# EAGLE schematic 24V AC SSR Board (EAGLE 7.3.0)
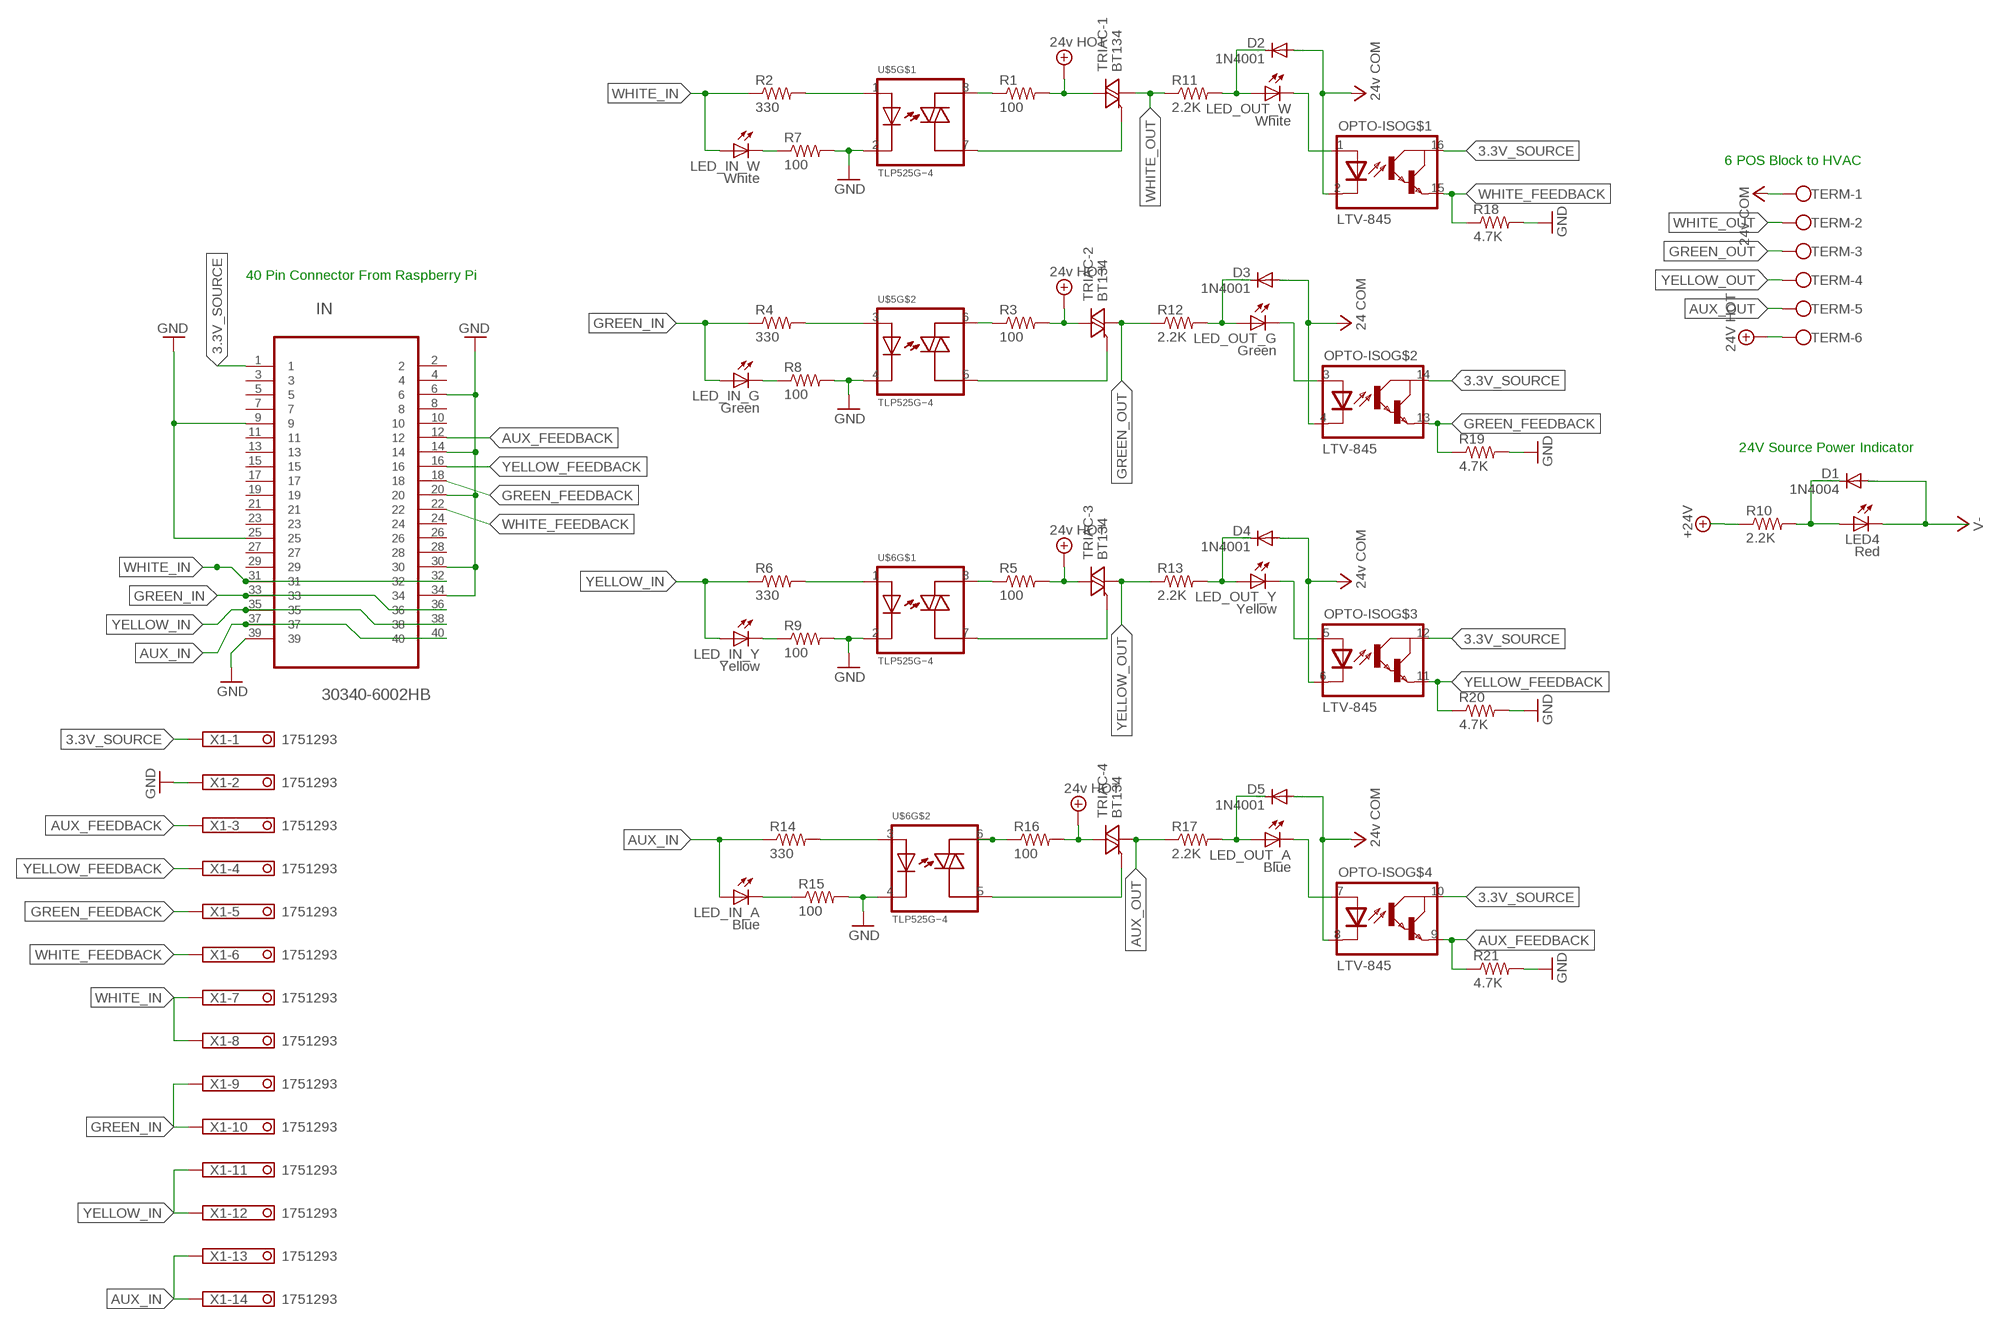
[diagram p0: schematic, sheet 1]

## Parts
D1  1N4004  [DO41-10]
D2  1N4001  1N4004  [DO41-10]
D3  1N4001  1N4004  [DO41-10]
D4  1N4001  1N4004  [DO41-10]
D5  1N4001  1N4004  [DO41-10]
IN  30340-6002HB  2540-6002UB  [3M_2540-6002UB]
LED4  Red  LED3MM  [LED3MM]
LED_IN_A  Blue  LED3MM  [LED3MM]
LED_IN_G  Green  LED3MM  [LED3MM]
LED_IN_W  White  LED3MM  [LED3MM]
LED_IN_Y  Yellow  LED3MM  [LED3MM]
LED_OUT_A  Blue  LED3MM  [LED3MM]
LED_OUT_G  Green  LED3MM  [LED3MM]
LED_OUT_W  White  LED3MM  [LED3MM]
LED_OUT_Y  Yellow  LED3MM  [LED3MM]
OPTO-ISO  LTV-845  [DIL16]
R1  100  R-US_0204/7  [0204/7]
R2  330  R-US_0204/7  [0204/7]
R3  100  R-US_0204/7  [0204/7]
R4  330  R-US_0204/7  [0204/7]
R5  100  R-US_0204/7  [0204/7]
R6  330  R-US_0204/7  [0204/7]
R7  100  R-US_0204/7  [0204/7]
R8  100  R-US_0204/7  [0204/7]
R9  100  R-US_0204/7  [0204/7]
R10  2.2K  R-US_0204/7  [0204/7]
R11  2.2K  R-US_0204/7  [0204/7]
R12  2.2K  R-US_0204/7  [0204/7]
R13  2.2K  R-US_0204/7  [0204/7]
R14  330  R-US_0204/7  [0204/7]
R15  100  R-US_0204/7  [0204/7]
R16  100  R-US_0204/7  [0204/7]
R17  2.2K  R-US_0204/7  [0204/7]
R18  4.7K  R-US_0204/7  [0204/7]
R19  4.7K  R-US_0204/7  [0204/7]
R20  4.7K  R-US_0204/7  [0204/7]
R21  4.7K  R-US_0204/7  [0204/7]
TERM  W237-6  [W237-6]
TRIAC-1  BT134  [SOT82]
TRIAC-2  BT134  [SOT82]
TRIAC-3  BT134  [SOT82]
TRIAC-4  BT134  [SOT82]
U$5  TLP525G−4  [DIL08]
U$6  TLP525G−4  [DIL08]
X1  1751293  [1751293]

## Nets
3.3V_SOURCE: IN.1 OPTO-ISO.10(COLLECTOR) OPTO-ISO.12(COLLECTOR) OPTO-ISO.14(COLLECTOR) OPTO-ISO.16(COLLECTOR) X1.1
+24V: R1.2 R3.2 R5.2 R10.1 R16.2 TERM.6 TRIAC-1.2(A2) TRIAC-2.2(A2) TRIAC-3.2(A2) TRIAC-4.2(A2) ; supply symbol labelled 24v HOT, 24V HOT
AUX_FEEDBACK: IN.12 OPTO-ISO.9(EMITTER) R21.1 X1.3
AUX_IN: IN.37 IN.40 LED_IN_A.A R14.1 X1.13 X1.14
AUX_OUT: R17.1 TERM.5 TRIAC-4.1(A1)
GND: IN.6 IN.9 IN.14 IN.20 IN.25 IN.30 IN.34 IN.39 R7.2 R8.2 R9.2 R15.2 R18.2 R19.2 R20.2 R21.2 U$5.2(CATHODE) U$5.4(CATHODE) U$6.2(CATHODE) U$6.4(CATHODE) X1.2
GREEN_FEEDBACK: IN.18 OPTO-ISO.13(EMITTER) R19.1 X1.5
GREEN_IN: IN.33 IN.36 LED_IN_G.A R4.1 X1.9 X1.10
GREEN_OUT: R12.1 TERM.3 TRIAC-2.1(A1)
N$1: TRIAC-1.3(G) U$5.7(T1)
N$2: R2.2 U$5.1(ANNODE)
N$3: TRIAC-4.3(G) U$6.5(T1)
N$4: R1.1 U$5.8(T2)
N$5: TRIAC-3.3(G) U$6.7(T1)
N$6: R4.2 U$5.3(ANNODE)
N$7: TRIAC-2.3(G) U$5.5(T1)
N$8: R3.1 U$5.6(T2)
N$9: LED_OUT_W.K(C) OPTO-ISO.1(ANNODE)
N$10: R6.2 U$6.1(ANNODE)
N$11: LED_OUT_G.K(C) OPTO-ISO.3(ANNODE)
N$12: R5.1 U$6.8(T2)
N$13: LED_OUT_Y.K(C) OPTO-ISO.5(ANNODE)
N$14: LED_OUT_A.K(C) OPTO-ISO.7(ANNODE)
N$17: LED_IN_W.K(C) R7.1
N$18: LED_IN_G.K(C) R8.1
N$20: LED_IN_Y.K(C) R9.1
N$21: D2.C LED_OUT_W.A R11.2
N$22: D3.C LED_OUT_G.A R12.2
N$23: D4.C LED_OUT_Y.A R13.2
N$24: D1.C LED4.A R10.2
N$27: R14.2 U$6.3(ANNODE)
N$28: LED_IN_A.K(C) R15.1
N$29: R16.1 U$6.6(T2)
N$30: D5.C LED_OUT_A.A R17.2
V-: D1.A D2.A D3.A D4.A D5.A LED4.K(C) OPTO-ISO.2(CATHODE) OPTO-ISO.4(CATHODE) OPTO-ISO.6(CATHODE) OPTO-ISO.8(CATHODE) TERM.1 ; supply symbol labelled 24v COM, 24 COM
WHITE_FEEDBACK: IN.22 OPTO-ISO.15(EMITTER) R18.1 X1.6
WHITE_IN: IN.31 IN.32 LED_IN_W.A R2.1 X1.7 X1.8
WHITE_OUT: R11.1 TERM.2 TRIAC-1.1(A1)
YELLOW_FEEDBACK: IN.16 OPTO-ISO.11(EMITTER) R20.1 X1.4
YELLOW_IN: IN.35 IN.38 LED_IN_Y.A R6.1 X1.11 X1.12
YELLOW_OUT: R13.1 TERM.4 TRIAC-3.1(A1)
Unconnected: IN.2 IN.3 IN.4 IN.5 IN.7 IN.8 IN.10 IN.11 IN.13 IN.15 IN.17 IN.19 IN.21 IN.23 IN.24 IN.26 IN.27 IN.28 IN.29

## Notes on the sheet
- 6 POS Block to HVAC
- 40 Pin Connector From Raspberry Pi
- 24V Source Power Indicator

## Library data of the parts
D1-D5 = diode:1N4004: DIODE general purpose rectifier, 1 A
IN = 3M_By_element14_Batch_1:2540-6002UB: Four-Wall Header; MPN: 2540-6002UB; OC_FARNELL: 1368965; OC_NEWARK: 46F4732; PACKAGE: Four-Wall Header, 40way; SUPPLIER: 3M
LED4 LED_IN_A LED_IN_G LED_IN_W LED_IN_Y LED_OUT_A LED_OUT_G LED_OUT_W LED_OUT_Y = led:LED: LED OSRAM: - CHIPLED LG R971, LG N971, LY N971, LG Q971, LY Q971, LO R971, LY R971 LH N974, LH R974 LS Q976, LO Q976, LY Q976 LO Q996 - Hyper CHIPLED LW Q18S LB Q993, LB Q99A, LB R99A - SideLED LS A670, LO A670, LY A670, LG A670, LP A670 LB A673, LV A673, LT A673, LW A673 LH A674 LY A675 LS A676, LA A676, LO A676, LY A676, LW A676 LS A679, LY A679, LG A679 - Hyper Micro SIDELED® LS Y876, LA Y876, LO Y876, LY Y876 LT Y87S - SmartLED LW L88C, LW L88S LB L89C, LB L89S, LG L890 LS L89K, LO L89K, LY L89K LS L896, LA L896, LO L896, LY L896 - TOPLED LS T670, LO T670, LY T670, LG T670, LP T670 LSG T670, LSP T670, LSY T670, LOP T670, LYG T670 LG T671, LOG T671, LSG T671 LB T673, LV T673, LT T673, LW T673 LH T674 LS T676, LA T676, LO T676, LY T676, LB T676, LH T676, LSB T676, LW T676 LB T67C, LV T67C, LT T67C, LS T67K, LO T67K, LY T67K, LW E67C LS E67B, LA E67B, LO E67B, LY E67B, LB E67C, LV E67C, LT E67C LW T67C LS T679, LY T679, LG T679 LS T770, LO T770, LY T770, LG T770, LP T770 LB T773, LV T773, LT T773, LW T773 LH T774 LS E675, LA E675, LY E675, LS T675 LS T776, LA T776, LO T776, LY T776, LB T776 LHGB T686 LT T68C, LB T68C - Hyper Mini TOPLED® LB M676 - Mini TOPLED Santana® LG M470 LS M47K, LO M47K, LY M47K Source: http://www.osram.convergy.de LUXEON: - LUMILED® LXK2-PW12-R00, LXK2-PW12-S00, LXK2-PW14-U00, LXK2-PW14-V00 LXK2-PM12-R00, LXK2-PM12-S00, LXK2-PM14-U00 LXK2-PE12-Q00, LXK2-PE12-R00, LXK2-PE12-S00, LXK2-PE14-T00, LXK2-PE14-U00 LXK2-PB12-K00, LXK2-PB12-L00, LXK2-PB12-M00, LXK2-PB14-N00, LXK2-PB14-P00, LXK2-PB14-Q00 LXK2-PR12-L00, LXK2-PR12-M00, LXK2-PR14-Q00, LXK2-PR14-R00 LXK2-PD12-Q00, LXK2-PD12-R00, LXK2-PD12-S00 LXK2-PH12-R00, LXK2-PH12-S00 LXK2-PL12-P00, LXK2-PL12-Q00, LXK2-PL12-R00 Source: www.luxeon.com KINGBRIGHT: KA-3528ASYC Source: www.kingbright.com
OPTO-ISO = myhvac:LTV-845
R1-R21 = rcl:R-US_: RESISTOR, American symbol
TERM = con-wago-500:W237-6: WAGO SCREW CLAMP; OC_FARNELL: unknown; OC_NEWARK: unknown
TRIAC-1-TRIAC-4 = myhvac:BT134: Planar passivated sensitive gate four quadrant triac in a SOT82 plastic package intended for use in general purpose bidirectional switching and phase control applications.
U$5 U$6 = myhvac:TLP525G−4
X1 = myhvac:1751293: MKDS 1/ 7-3,5 Printklemme Nennstrom: 10 A Bemessungsspannung: 160 V Raster: 3,5 mm Polzahl: 7 Montageart: Löten Anschlussart: Schraubanschluss Anschlussrichtung vom Leiter zur Platine: 0° Source: http://eshop.phoenixcontact.com .. 1751293.pdf; OC_FARNELL: unknown; OC_NEWARK: unknown